# Altium schematic sheet Power.SchDoc
size A
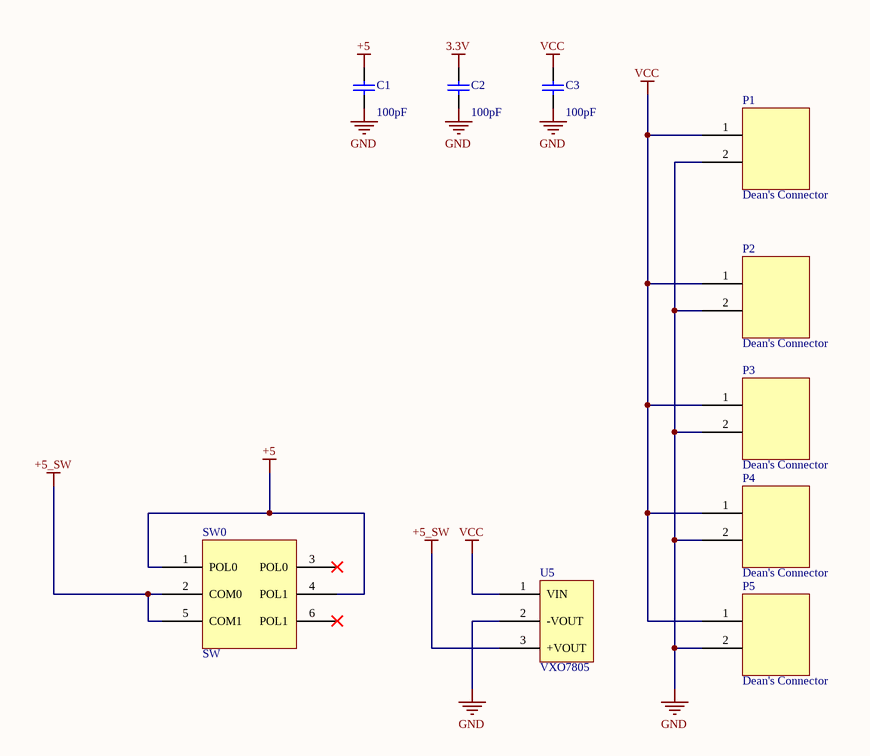
[diagram p0: Power.SchDoc]

## Parts
C1  value 100pF  [C1206]  (hidden comment: Cap Semi)
C2  value 100pF  [C1206]  (hidden comment: Cap Semi)
C3  value 100pF  [C1206]  (hidden comment: Cap Semi)
P1  Dean's Connector  [DEAN_CONN]
P2  Dean's Connector  [DEAN_CONN]
P3  Dean's Connector  [DEAN_CONN]
P4  Dean's Connector  [DEAN_CONN]
P5  Dean's Connector  [DEAN_CONN]
SW0  SW  [SW]
U5  VXO7805  [VXO78-1000]

## Nets
3.3V: C2.2
+5: C1.2 SW0.1(POL0) SW0.4(POL1)
+5_SW: SW0.2(COM0) SW0.5(COM1) U5.3(+VOUT)
GND: C1.1 C2.1 C3.1 P1.2 P2.2 P3.2 P4.2 P5.2 U5.2(-VOUT)
VCC: C3.2 P1.1 P2.1 P3.1 P4.1 P5.1 U5.1(VIN)

Not connected (* = marked no-connect by the designer): SW0 3(POL0)* 6(POL1)*

## Library data of the parts
C1-C3 = Cap Semi: Capacitor (Semiconductor SIM Model); Published: 8-Jun-2000; LatestRevisionDate: 29-May-2009; LatestRevisionNote: IPC-7351 Footprint Added.; PackageReference: C1206; Publisher: Altium Limited; PackageDescription: Chip Capacitor